# Altium schematic sheet Jukebox Peripherals.SchDoc: Jukebox Peripherals
size B; DrawnBy: Tim Menninger; Revision: 1.1; SheetNumber: 3; SheetTotal: 5
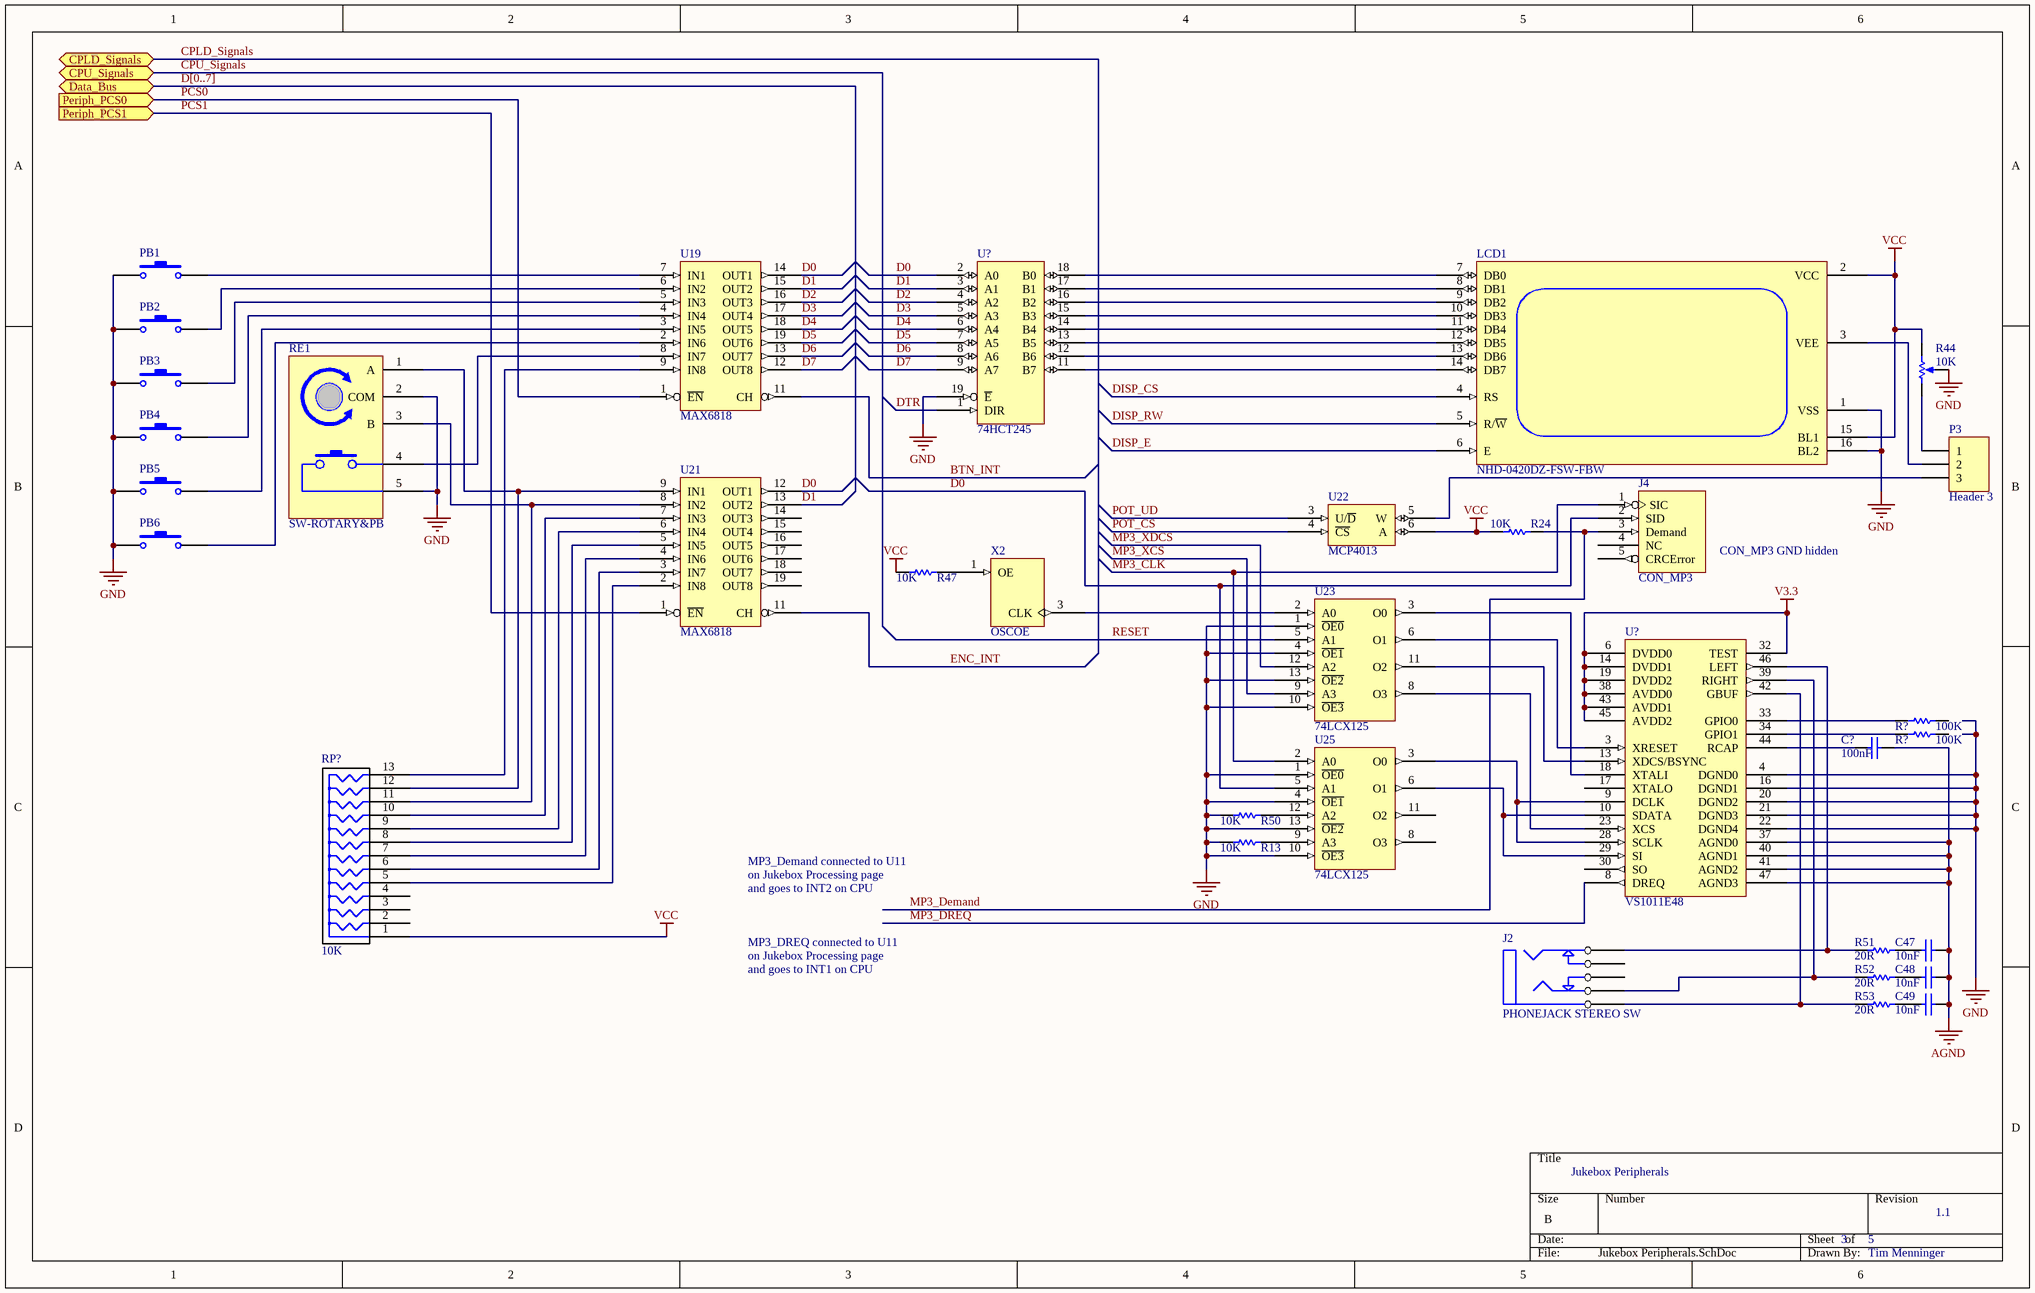
[diagram p0: Jukebox Peripherals.SchDoc]

## Parts
(Parts that share a designator on the sheet are numbered #1, #2 ... from top to bottom, then left to right.)
C47  value 10nF  [C0805]  (hidden comment: Cap)
C48  value 10nF  [C0805]  (hidden comment: Cap)
C49  value 10nF  [C0805]  (hidden comment: Cap)
C?  value 100nF  [C0805]  (hidden comment: Cap)
J2  PHONEJACK STEREO SW  [SJ1-352]
J4  CON_MP3  [MDIN6]
LCD1  NHD-0420DZ-FSW-FBW  [20x4Disp]
P3  Header 3  [HDR1X3]
PB1  SW-PB  [PB_EG4791]  (value not drawn)
PB2  SW-PB  [PB_EG4791]  (value not drawn)
PB3  SW-PB  [PB_EG4791]  (value not drawn)
PB4  SW-PB  [PB_EG4791]  (value not drawn)
PB5  SW-PB  [PB_EG4791]  (value not drawn)
PB6  SW-PB  [PB_EG4791]  (value not drawn)
R13  value 10K  [6-0805_L]  (hidden comment: Res1)
R24  value 10K  [6-0805_L]  (hidden comment: Res1)
R44  value 10K  [VR4]  (hidden comment: RPot)
R47  value 10K  [6-0805_L]  (hidden comment: Res1)
R50  value 10K  [6-0805_L]  (hidden comment: Res1)
R51  value 20R  [6-0805_L]  (hidden comment: Res1)
R52  value 20R  [6-0805_L]  (hidden comment: Res1)
R53  value 20R  [6-0805_L]  (hidden comment: Res1)
R?#1  value 100K  [6-0805_L]  (hidden comment: Res1)
R?#2  value 100K  [6-0805_L]  (hidden comment: Res1)
RE1  SW-ROTARY&PB  [ROTENCPB]
RP?  10K
U19  MAX6818  [SSOP20]
U21  MAX6818  [SSOP20]
U22  MCP4013  [SOT-23-6]
U23  74LCX125  [SOIC 14]
U25  74LCX125  [SOIC 14]
U?#1  74HCT245  [DIP20]
U?#2  VS1011E48  [LQFP48]
X2  OSCOE  [DIP14-4]

## Ports
CPLD_Signals, CPU_Signals, Data_Bus, Periph_PCS0 (in), Periph_PCS1 (in)

## Nets
AGND: C47.2 C48.2 C49.2 C?.2 U23.7(AGND) U25.7(AGND) U?#2.37(AGND0) U?#2.40(AGND1) U?#2.41(AGND2) U?#2.47(AGND3)
GND: LCD1.1(VSS) LCD1.16(BL2) PB1.1 PB2.1 PB3.1 PB4.1 PB5.1 PB6.1 R13.1 R44.3(TAP) R50.1 RE1.2(COM) RE1.5 U19.10(GND) U21.10(GND) U22.2(GND) U23.1(~{O}~{E}~{0}) U23.4(~{O}~{E}~{1}) U23.10(~{OE3}) U23.13(~{OE2}) U25.1(~{O}~{E}~{0}) U25.4(~{O}~{E}~{1}) U25.10(~{OE3}) U25.13(~{OE2}) U?#1.10(GND) U?#1.19(~{E}) U?#2.4(DGND0) U?#2.16(DGND1) U?#2.20(DGND2) U?#2.21(DGND3) U?#2.22(DGND4) X2.2(GND)
V3.3: U23.14(VCC) U25.14(VCC) U?#2.6(DVDD0) U?#2.14(DVDD1) U?#2.19(DVDD2) U?#2.32(TEST) U?#2.38(AVDD0) U?#2.43(AVDD1) U?#2.45(AVDD2)
VCC: LCD1.2(VCC) LCD1.15(BL1) R24.1 R44.2(BOT) R47.1 RP?.1 U19.20(VCC) U21.20(VCC) U22.1(VCC) U22.6(A) U?#1.20(VCC) X2.4(VCC)
BTN_INT: U19.11(CH)
D0: J4.2(SID) U19.14(OUT1) U21.12(OUT1) U25.5(A1) U?#1.2(A0)
D1: U19.15(OUT2) U21.13(OUT2) U?#1.3(A1)
D2: U19.16(OUT3) U?#1.4(A2)
D3: U19.17(OUT4) U?#1.5(A3)
D4: U19.18(OUT5) U?#1.6(A4)
D5: U19.19(OUT6) U?#1.7(A5)
D6: U19.13(OUT7) U?#1.8(A6)
D7: U19.12(OUT8) U?#1.9(A7)
DISP_CS: LCD1.4(RS)
DISP_E: LCD1.6(E)
DISP_RW: LCD1.5(R/~{W})
DTR: U?#1.1(DIR)
ENC_INT: U21.11(CH)
MP3_CLK: J4.1(SIC) U25.2(A0)
MP3_Demand: J4.3(Demand) R24.2
MP3_DREQ: U?#2.8(DREQ)
MP3_XCS: U23.9(A3)
MP3_XDCS: U23.12(A2)
PCS0: U19.1(~{EN}) ; port Periph_PCS0
PCS1: U21.1(~{EN}) ; port Periph_PCS1
POT_CS: U22.4(~{CS})
POT_UD: U22.3(U/~{D})
RESET: U23.5(A1)
NetC47_1: C47.1 R51.1
NetC48_1: C48.1 R52.1
NetC49_1: C49.1 R53.1
NetC?_1: C?.1 U?#2.44(RCAP)
NetJ2_A: J2.A(RING) R51.2 U?#2.46(LEFT)
NetJ2_D: J2.D(TIP) R52.2 U?#2.39(RIGHT)
NetJ2_E: J2.E(SLEEVE) R53.2 U?#2.42(GBUF)
NetLCD1_3: LCD1.3(VEE) P3.2
NetLCD1_7: LCD1.7(DB0) U?#1.18(B0)
NetLCD1_8: LCD1.8(DB1) U?#1.17(B1)
NetLCD1_9: LCD1.9(DB2) U?#1.16(B2)
NetLCD1_10: LCD1.10(DB3) U?#1.15(B3)
NetLCD1_11: LCD1.11(DB4) U?#1.14(B4)
NetLCD1_12: LCD1.12(DB5) U?#1.13(B5)
NetLCD1_13: LCD1.13(DB6) U?#1.12(B6)
NetLCD1_14: LCD1.14(DB7) U?#1.11(B7)
NetP3_1: P3.1 R44.1(TOP)
NetP3_3: P3.3 U22.5(W)
NetPB1_2: PB1.2 U19.7(IN1)
NetPB2_2: PB2.2 U19.6(IN2)
NetPB3_2: PB3.2 U19.5(IN3)
NetPB4_2: PB4.2 U19.4(IN4)
NetPB5_2: PB5.2 U19.3(IN5)
NetPB6_2: PB6.2 U19.2(IN6)
NetR13_2: R13.2 U25.9(A3)
NetR47_2: R47.2 X2.1(OE)
NetR50_2: R50.2 U25.12(A2)
NetR?#1_2: R?#1.2 U?#2.33(GPIO0)
NetR?#2_2: R?#2.2 U?#2.34(GPIO1)
NetRE1_1: RE1.1(A) RP?.12 U21.9(IN1)
NetRE1_3: RE1.3(B) RP?.11 U21.8(IN2)
NetRE1_4: RE1.4 U19.8(IN7)
NetRP?_5: RP?.5 U21.2(IN8)
NetRP?_6: RP?.6 U21.3(IN7)
NetRP?_7: RP?.7 U21.4(IN6)
NetRP?_8: RP?.8 U21.5(IN5)
NetRP?_9: RP?.9 U21.6(IN4)
NetRP?_10: RP?.10 U21.7(IN3)
NetRP?_13: RP?.13 U19.9(IN8)
NetU23_2: U23.2(A0) X2.3(CLK)
NetU23_3: U23.3(O0) U?#2.18(XTALI)
NetU23_6: U23.6(O1) U?#2.3(XRESET)
NetU23_8: U23.8(O3) U?#2.23(XCS)
NetU23_11: U23.11(O2) U?#2.13(XDCS/BSYNC)
NetU25_3: U25.3(O0) U?#2.9(DCLK) U?#2.28(SCLK)
NetU25_6: U25.6(O1) U?#2.10(SDATA) U?#2.29(SI)

Not connected (* = marked no-connect by the designer): J2 B(RINGSW) C(TIPSW); J4 4(NC) 5(CRCError) 6(GND); R?#1 1; R?#2 1; RP? 2 3 4; U21 14(OUT3) 15(OUT4) 16(OUT5) 17(OUT6) 18(OUT7) 19(OUT8); U25 8(O3) 11(O2); U?#2 17(XTALO) 30(SO)

## Buses and harness runs
bus CPLD_Signals = port CPLD_Signals
bus CPU_Signals = port CPU_Signals
bus D[0..7] = port Data_Bus

## Notes on the sheet
- CON_MP3 GND hidden
- MP3_Demand connected to U11
- on Jukebox Processing page
- and goes to INT2 on CPU
- MP3_DREQ connected to U11
- and goes to INT1 on CPU

## Library data of the parts
C47-C49 C? = Cap: Capacitor; Published: 8-Jun-2000; LatestRevisionDate: 17-Jul-2002; LatestRevisionNote: Re-released for DXP Platform.; PackageReference: RAD-0.3; Publisher: Altium Limited; PackageDescription: Radial Cap, Thru-Hole; 2 Leads; 0.3 in Pin Spacing
J2 = PHONEJACK STEREO SW: 3.5mm Stereo Jack with Switches
J4 = CON_MP3: MP3 Connector
LCD1 = LCDBL16PIN: Single E LCD with Backlight
P3 = Header 3: Header, 3-Pin; LatestRevisionDate: 17-Jul-2002; LatestRevisionNote: Re-released for DXP Platform.; Publisher: Altium Limited
PB1-PB6 = SW-PB: Switch; Published: 24-Mar-1999; LatestRevisionDate: 17-Jul-2002; LatestRevisionNote: Re-released for DXP Platform.; PackageReference: SPST-2; Publisher: Altium Limited; PackageDescription: Switch; 2 Leads
R13 R24 R47 R50-R53 R?#1 R?#2 = Res1: Resistor; Published: 8-Jun-2000; LatestRevisionDate: 17-Jul-2002; LatestRevisionNote: Re-released for DXP Platform.; PackageReference: AXIAL-0.3; Publisher: Altium Limited; PackageDescription: Axial Device, Thru-Hole; 2 Leads; 0.3 in Pin Spacing
R44 = RPot: Potentiometer; Sim Note: Enter the Resistance value and the set point into parameter fields.; Set Position: 0.5; Published: 8-Jun-2000; LatestRevisionDate: 17-Jul-2002; LatestRevisionNote: Re-released for DXP Platform.; PackageReference: VR5; Publisher: Altium Limited; PackageDescription: Variable Resistor, Thru-Hole; 3 Leads
RE1 = SW-ROTARY&PB: Rotary Encoder with Built-In Push Button
RP? = RPACK12
U19 U21 = MAX6818: Octal Switch Debouncer
U?#1 = 74HCT245: Octal Bus Transceiver
X2 = OSCOE: Oscillator with Active High Output Enable